# EAGLE design Power edge (EAGLE 9.4.2)
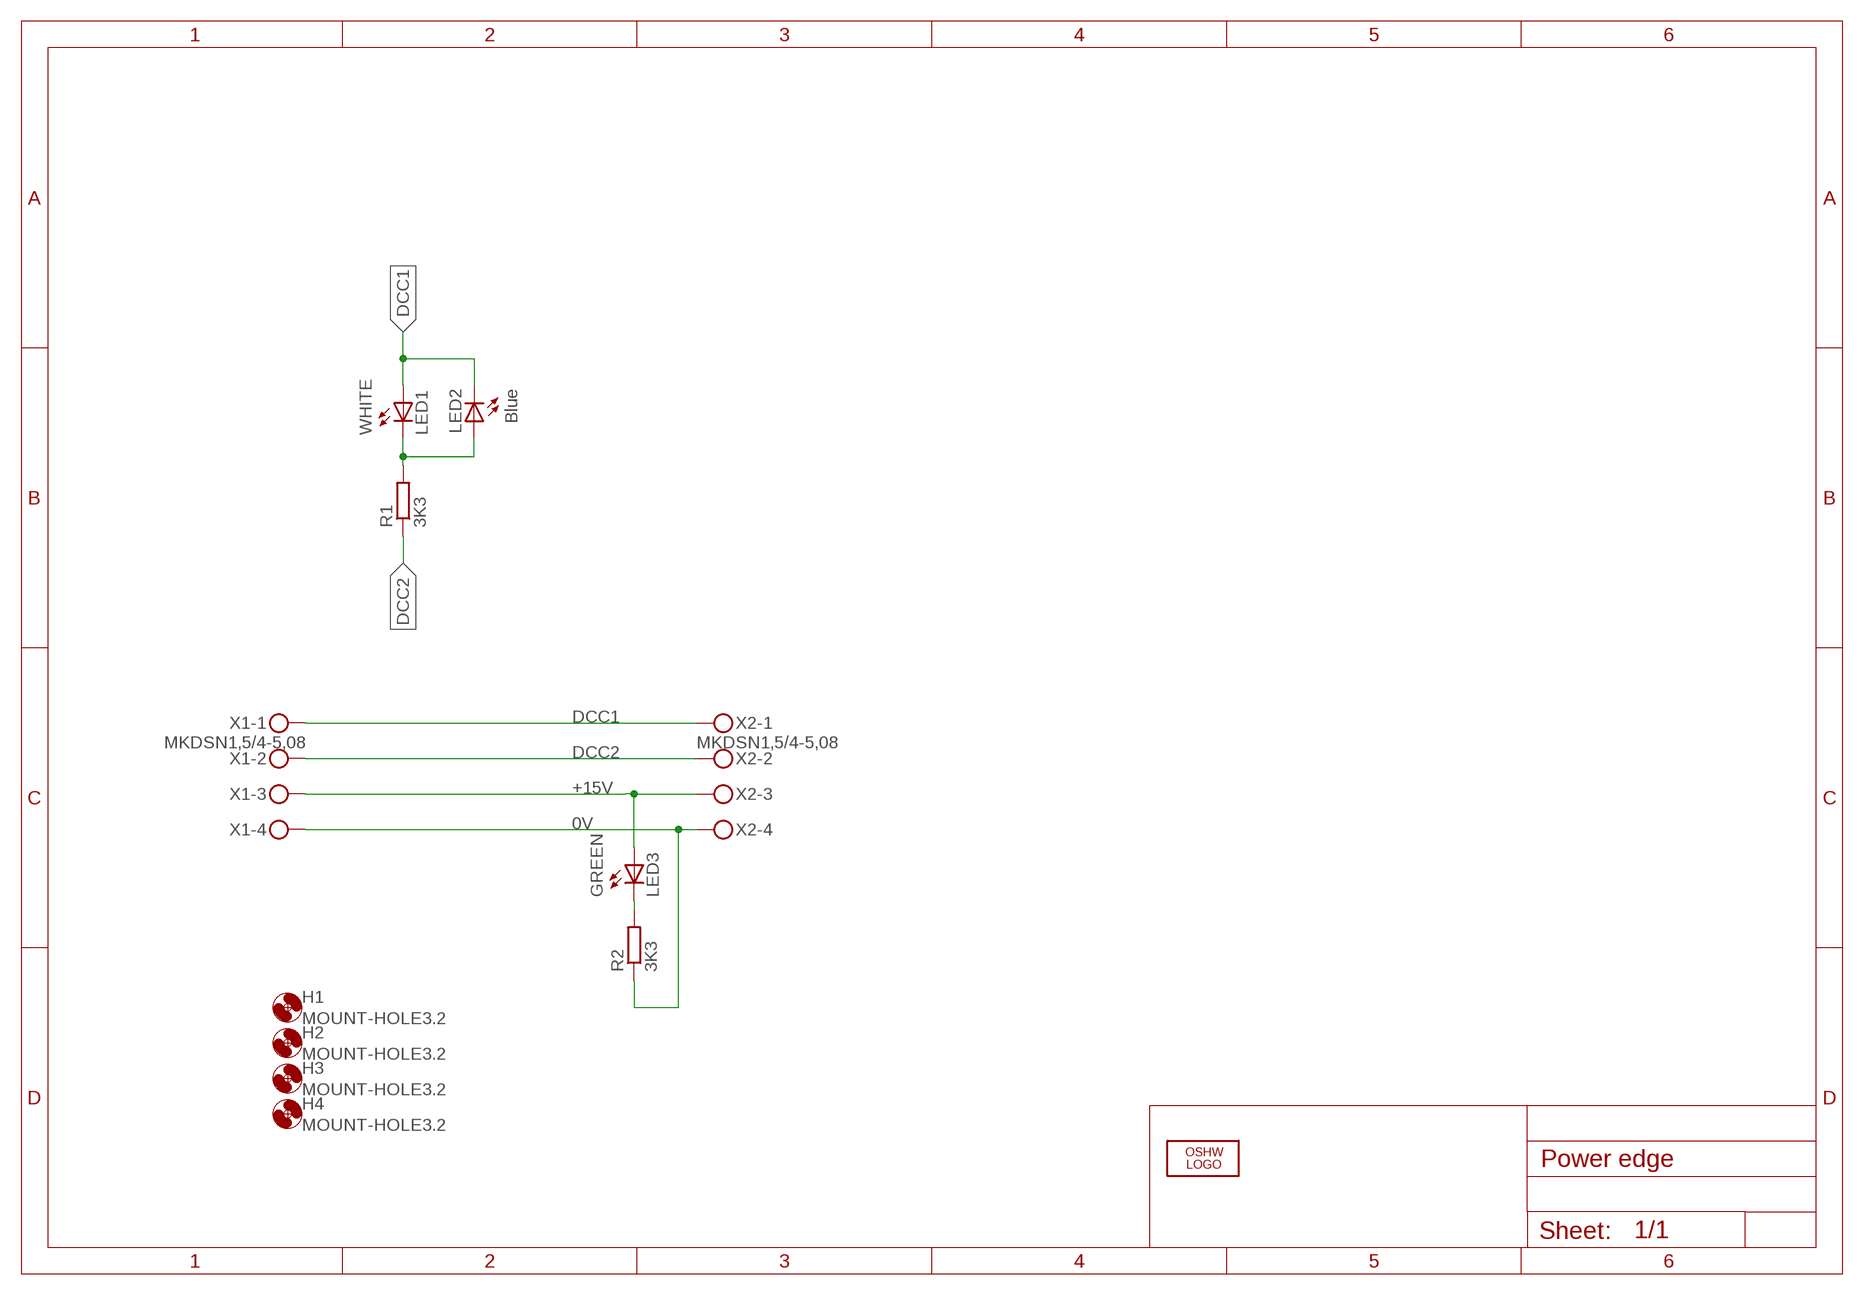
[diagram p0: schematic, sheet 1]

## Parts
H1  MOUNT-HOLE3.2  [3,2]
H2  MOUNT-HOLE3.2  [3,2]
H3  MOUNT-HOLE3.2  [3,2]
H4  MOUNT-HOLE3.2  [3,2]
LED1  WHITE  LED3MM  [LED3MM]
LED2  Blue  LED3MM  [LED3MM]
LED3  GREEN  LED3MM  [LED3MM]
LOGO1  OSHW_LOGO_6MILX0200-NT  [OSHW_6X200_NOTEXT]
R1  3K3  R-EU_R0805  [R0805]
R2  3K3  R-EU_R0805  [R0805]
X1  MKDSN1,5/4-5,08  [MKDSN1,5/4-5,08]
X2  MKDSN1,5/4-5,08  [MKDSN1,5/4-5,08]

## Nets
0V: R2.1 X1.4 X2.4
+15V: LED3.A X1.3 X2.3
DCC1: LED1.A LED2.K(C) X1.1 X2.1
DCC2: R1.1 X1.2 X2.2
N$1: LED3.K(C) R2.2
N$32: LED1.K(C) LED2.A R1.2

## Library data of the parts
H1-H4 = holes:MOUNT-HOLE: MOUNTING HOLE with drill center marker
LED1-LED3 = adafruit:LED: LED OSRAM: - CHIPLED LG R971, LG N971, LY N971, LG Q971, LY Q971, LO R971, LY R971 LH N974, LH R974 LS Q976, LO Q976, LY Q976 LO Q996 - Hyper CHIPLED LW Q18S LB Q993, LB Q99A, LB R99A - SideLED LS A670, LO A670, LY A670, LG A670, LP A670 LB A673, LV A673, LT A673, LW A673 LH A674 LY A675 LS A676, LA A676, LO A676, LY A676, LW A676 LS A679, LY A679, LG A679 - Hyper Micro SIDELED® LS Y876, LA Y876, LO Y876, LY Y876 LT Y87S - SmartLED LW L88C, LW L88S LB L89C, LB L89S, LG L890 LS L89K, LO L89K, LY L89K LS L896, LA L896, LO L896, LY L896 - TOPLED LS T670, LO T670, LY T670, LG T670, LP T670 LSG T670, LSP T670, LSY T670, LOP T670, LYG T670 LG T671, LOG T671, LSG T671 LB T673, LV T673, LT T673, LW T673 LH T674 LS T676, LA T676, LO T676, LY T676, LB T676, LH T676, LSB T676, LW T676 LB T67C, LV T67C, LT T67C, LS T67K, LO T67K, LY T67K, LW E67C LS E67B, LA E67B, LO E67B, LY E67B, LB E67C, LV E67C, LT E67C LW T67C LS T679, LY T679, LG T679 LS T770, LO T770, LY T770, LG T770, LP T770 LB T773, LV T773, LT T773, LW T773 LH T774 LS E675, LA E675, LY E675, LS T675 LS T776, LA T776, LO T776, LY T776, LB T776 LHGB T686 LT T68C, LB T68C - Hyper Mini TOPLED® LB M676 - Mini TOPLED Santana® LG M470 LS M47K, LO M47K, LY M47K Source: http://www.osram.convergy.de/
LOGO1 = ohw-logo:OSHW_LOGO_6MIL
R1 R2 = rcl:R-EU_: RESISTOR, European symbol
X1 X2 = con-phoenix-508:MKDSN1,5/4-5,08: MKDSN 1,5/ 4-5,08 Printklemme Nennstrom: 13,5 A Nennspannung: 250 V Rastermaß: 5,08 mm Polzahl: 4 Anschlussart: Schraubanschluss Montage: Löten Anschlussrichtung Leiter/Platine: 0 ° Artikelnummer: 1729144 Source: http://eshop.phoenixcontact.com .. 1729144.pdf; MPN: SMKDSN1,5/4-5,08; OC_FARNELL: 1792905; OC_NEWARK: 70R0300

## Board
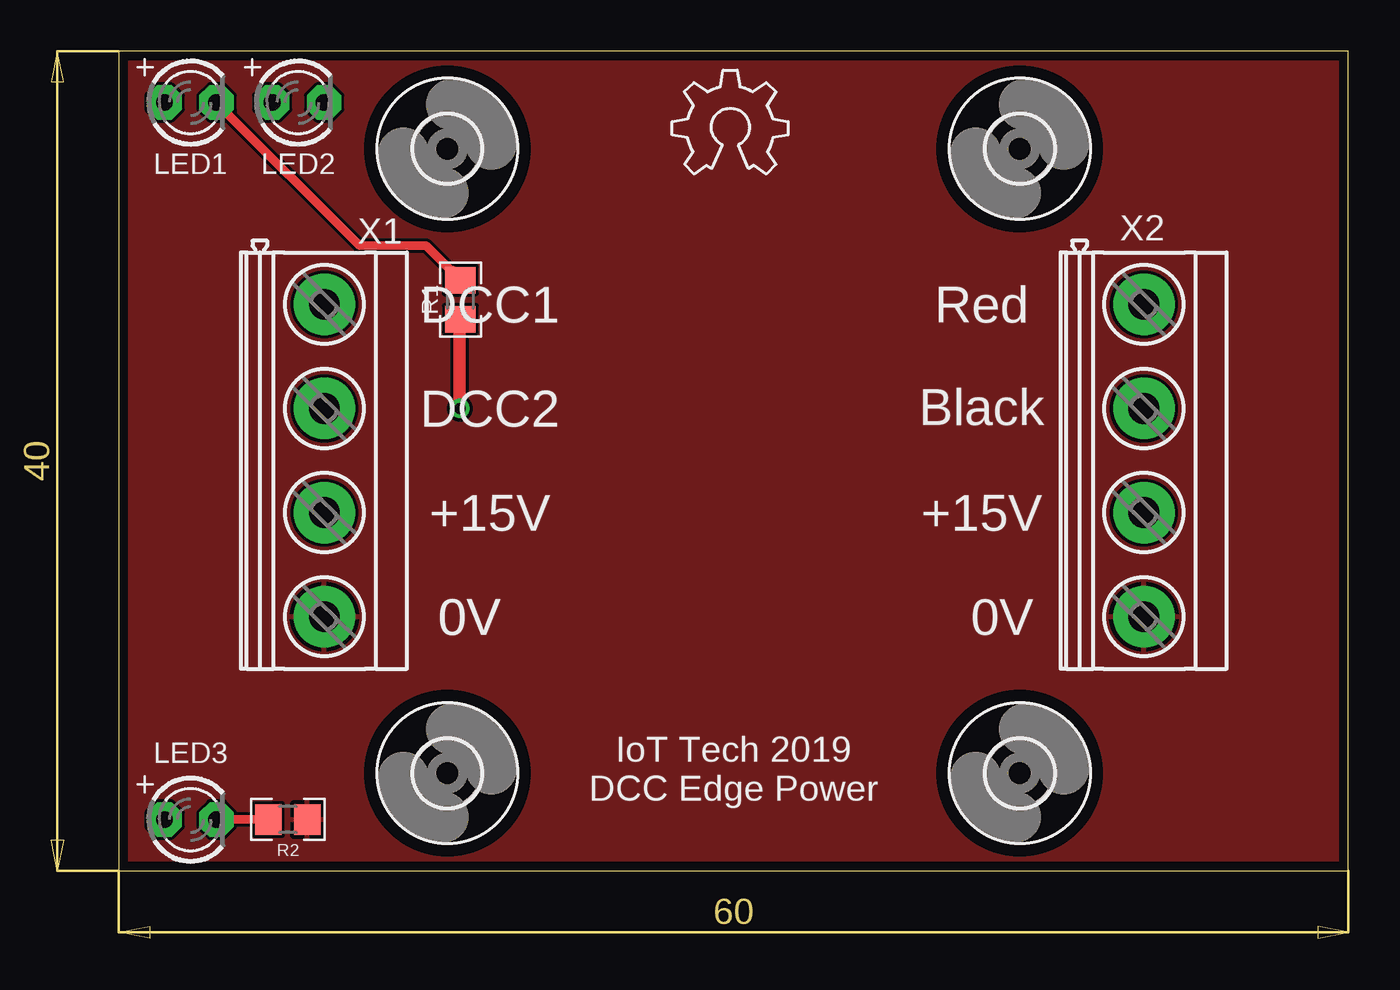
[diagram p1: board, top side]
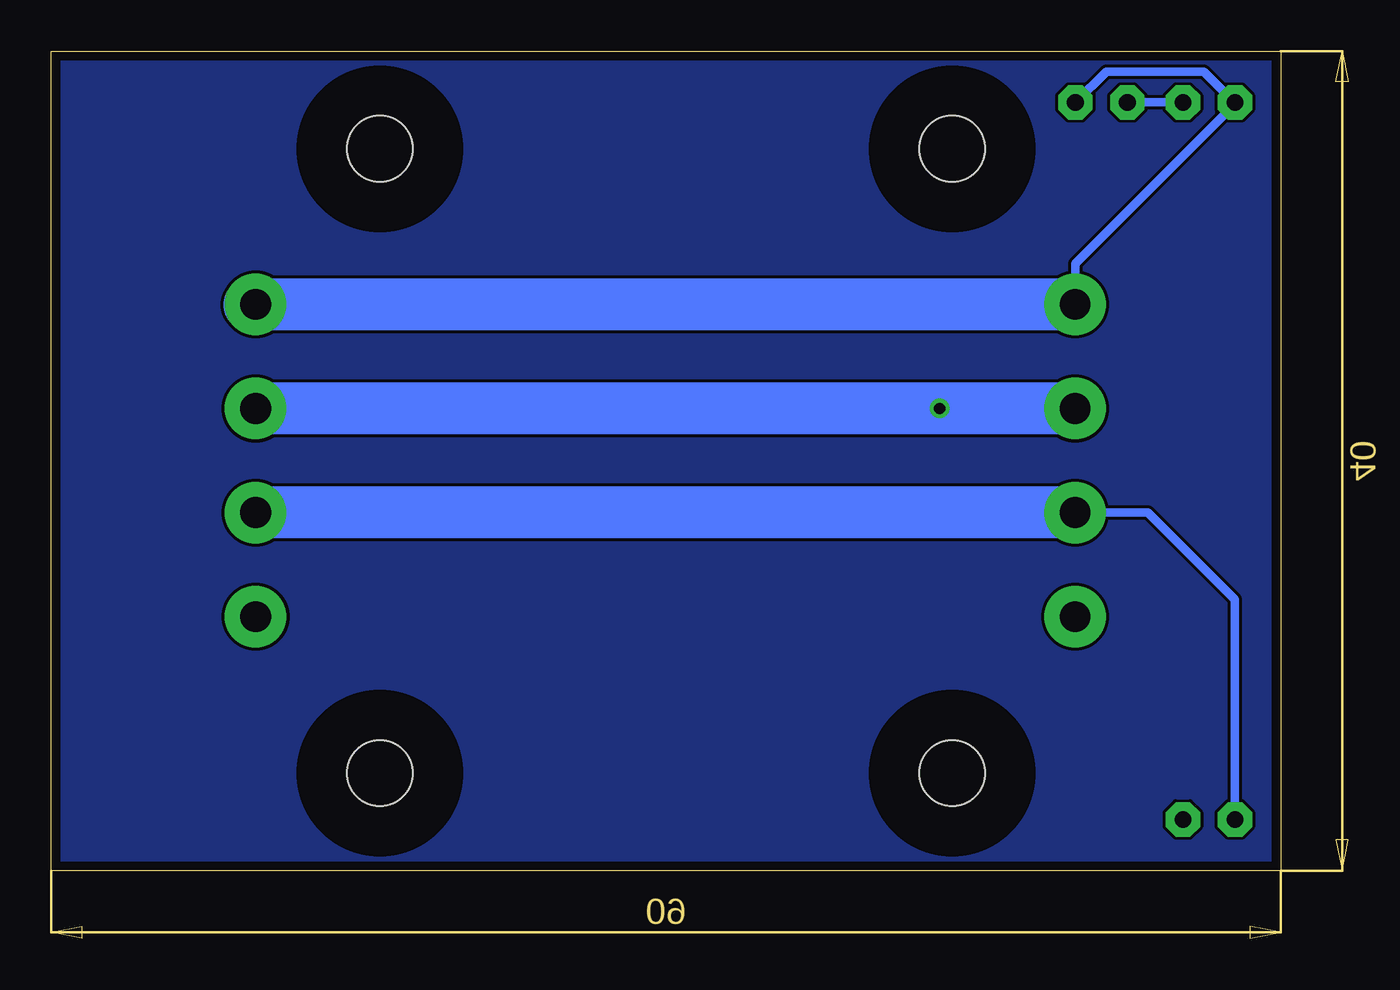
[diagram p2: board, bottom side, seen from below]

Size 60 x 40 mm. Coordinates in mm from the lower left corner, seen from the top.
Outline: 0,0 60,0 60,40 0,40 0,0
Copper layers (1*16): Top 0.018mm / dielectric 1.55mm / Bottom 0.018mm
Design rules "eC-PCB_proto-2-layer": minimum track width 0.15mm, minimum drill 0.25mm, track to track 0.15mm, track to pad 0.15mm, pad to pad 0.15mm, via to via 0.15mm, smd to smd 0.15mm, copper to edge 0.45mm, drill to drill 0.3mm, minimum pad ring 0.2mm, minimum via ring 0.2mm, stop-mask expansion 0.1mm, vias tented up to drill 0mil, thermal gap 0.2mm

### Footprints (pad centres in the part's own frame; a part is rotated, then mirrored left to right if it is on the bottom)
3,2 = hole 3.2: 0,0
LED3MM = drill 0.813 pad 1.676 octagon: A -1.27,0; K 1.27,0
R0805 = smd 1.3 x 1.5: 1 -0.95,0; 2 0.95,0
MKDSN1,5/4-5,08 = drill 1.5 pad 3: 1 -7.641,0.025; 2 -2.561,0.025; 3 2.519,0.025; 4 7.599,0.025

### Placement (x,y rotation side)
H1  16.03,35.24 0 top
H2  43.97,35.24 0 top
H3  16.03,4.76 0 top
H4  43.97,4.76 0 top
LED1  3.5,37.5 0 top
LED2  8.75,37.5 0 top
LED3  3.5,2.5 0 top
LOGO1  27,34 0 top
R1  16.67,27.87 90 top
R2  8.25,2.5 180 top
X1  10,20 270 top
X2  50,20 270 top

### Tracks (layer width: path | path; a pad name or v marks a point on that pad's centre or on a via)
0V
  pour Top: 0,40 60,40 60,0 0,0
+15V
  Bottom 0.406: X1.3 6.48,17.48 2.23,13.23 LED3.A
  Bottom 2.54: X1.3 X2.3
DCC1
  Bottom 0.406: LED2.K 8.5,39 3.75,39 2.25,37.5 LED1.A 2.39,37.28 10.02,29.64 X1.1
  Bottom 2.54: X2.1 50.32,27.62 50.3,27.64 X1.1
DCC2  (via drill 0.55)
  Top 0.61: R1.1 16.64,26.89 v16.64,22.56
  Bottom 2.54: X1.2 v16.64,22.56 X2.2
GND
  pour Bottom: 0,40 60,40 60,0 0,0
N$1
  Top 0.406: LED3.K R2.2
N$32
  Top 0.406: LED1.K 4.9,37.35 11.75,30.5 15,30.5 16.28,29.22 16.28,29.21
  Top 0.61: 16.28,29.21 R1.2
  Bottom 0.406: LED2.A LED1.K

### Text on the board
tPlace: DCC1 | Red | DCC2 | Black | +15V | +15V | 0V | 0V | 0V | IoT Tech 2019 / DCC Edge Power